# EAGLE design node (EAGLE 5.12)
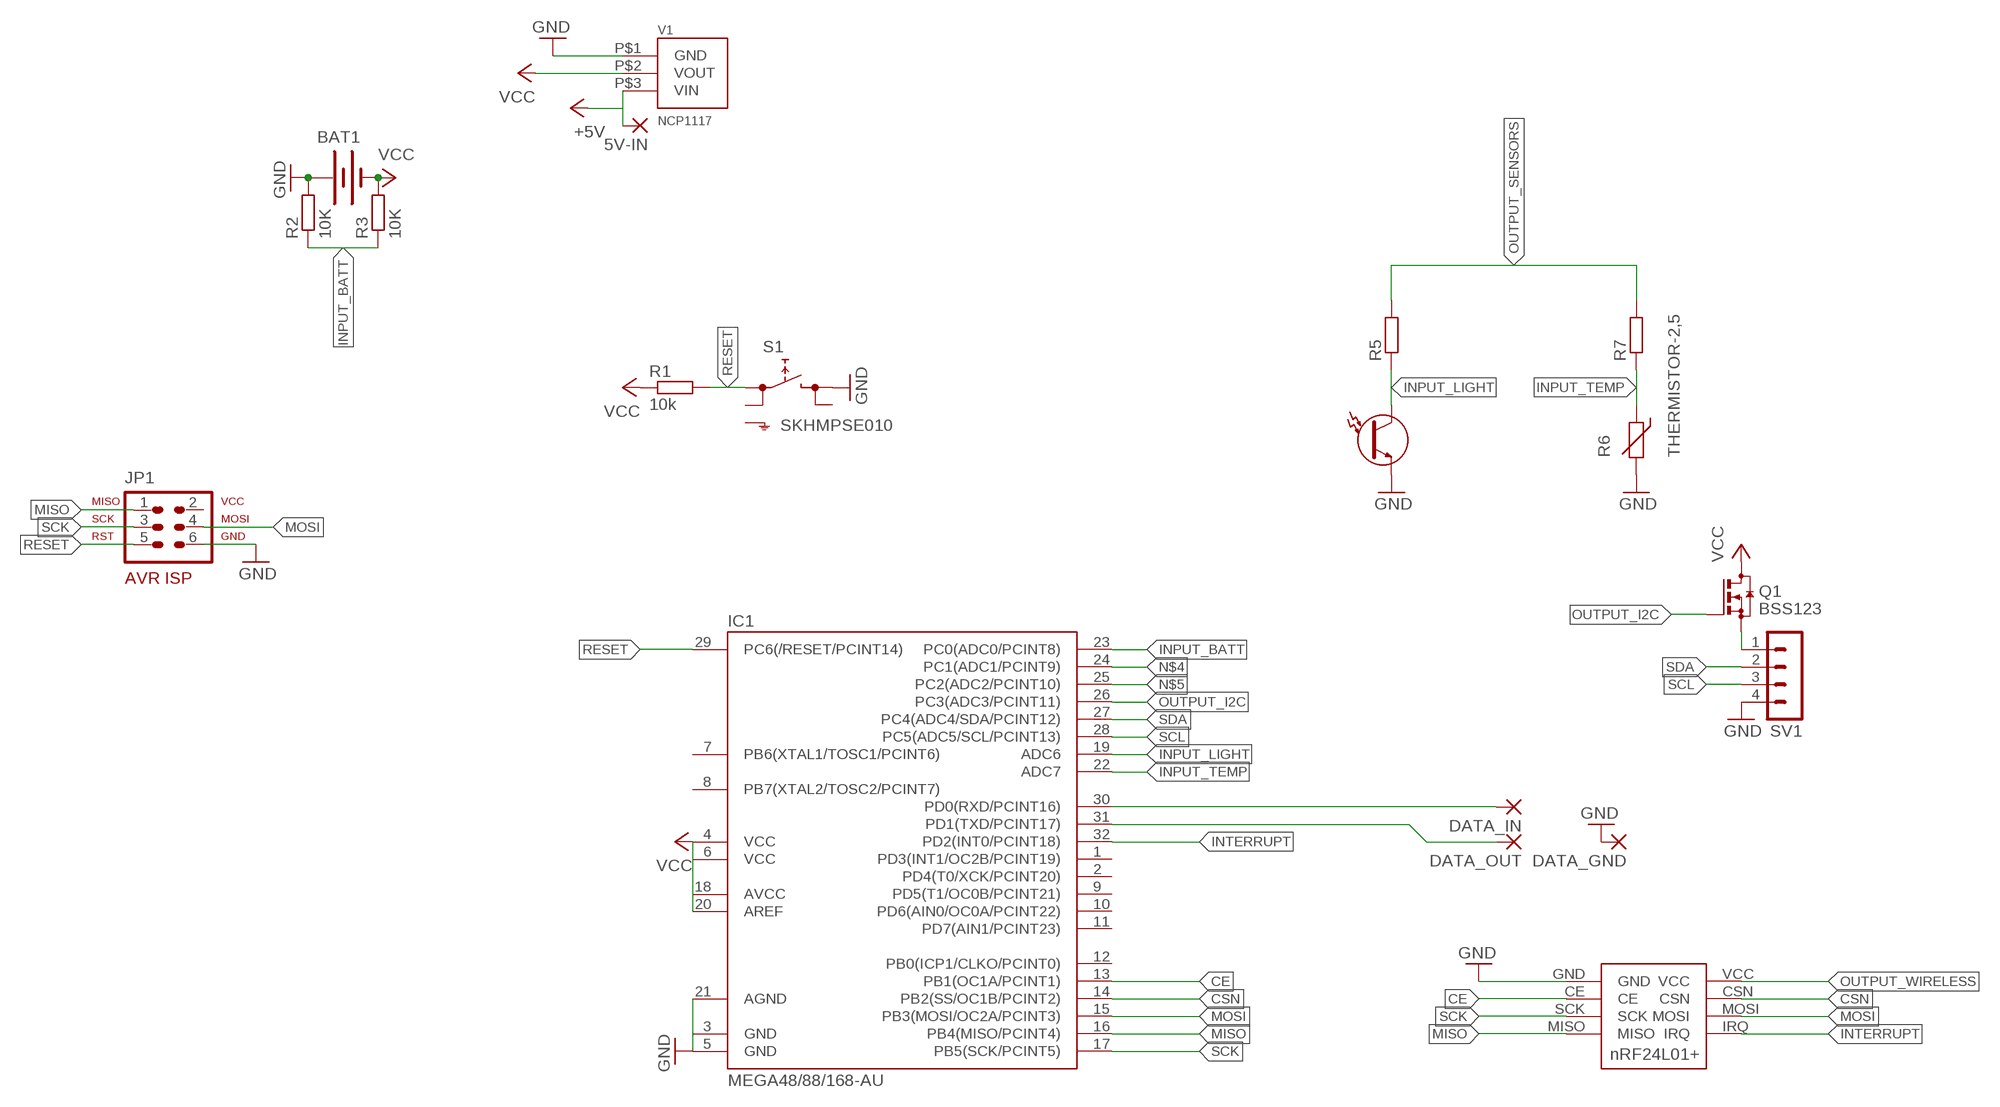
[diagram p0: schematic, sheet 1]

## Parts
5V-IN  2,54/1,1  [2,54/1,1]
BAT1  BATTERY20PTH  [BATTCOM_20MM_PTH]
CHINESE1  NRF24L01+CHINESE  [CHINESE]
DATA_GND  2,54/1,1  [2,54/1,1]
DATA_IN  2,54/1,1  [2,54/1,1]
DATA_OUT  2,54/1,1  [2,54/1,1]
IC1  MEGA48/88/168-AU  [TQFP32-08]
JP1  AVR-ISP-6VERT  [AVR-ISP-6]
Q1  BSS123  [SOT23]
R1  10k  R-EU_R0805  [R0805]
R2  10K  R-EU_M0805  [M0805]
R3  10K  R-EU_M0805  [M0805]
R5  R-EU_M0805  [M0805]
R6  THERMISTOR-2,5  [RS-2,5]
R7  R-EU_M0805  [M0805]
S1  SKHMPSE010  [SKHMPXE010]
SV1  MA04-1  [MA04-1]
U$1  FLD00030  [0603]
V1  NCP1117  [SOT_223]

## Nets
+5V: 5V-IN.1(P) V1.P$3(VIN)
CE: CHINESE1.CE IC1.13(PB1(OC1A/PCINT1))
CSN: CHINESE1.CSN IC1.14(PB2(SS/OC1B/PCINT2))
GND: BAT1.1(+) CHINESE1.GND DATA_GND.1(P) IC1.3(GND) IC1.5(GND) IC1.21(AGND) JP1.6 R2.2 R6.2 S1.3(2.1) SV1.4 U$1.EMITTER V1.P$1(GND)
INPUT_BATT: IC1.23(PC0(ADC0/PCINT8)) R2.1 R3.1
INPUT_LIGHT: IC1.19(ADC6) R5.1 U$1.COLLECTOR
INPUT_TEMP: IC1.22(ADC7) R6.1 R7.1
INTERRUPT: CHINESE1.IRQ IC1.32(PD2(INT0/PCINT18))
MISO: CHINESE1.MISO IC1.16(PB4(MISO/PCINT4)) JP1.1
MOSI: CHINESE1.MOSI IC1.15(PB3(MOSI/OC2A/PCINT3)) JP1.4
N$4: IC1.24(PC1(ADC1/PCINT9))
N$5: IC1.25(PC2(ADC2/PCINT10))
N$6: Q1.2(S) SV1.1
OUTPUT_I2C: IC1.26(PC3(ADC3/PCINT11)) Q1.1(G)
OUTPUT_SENSORS: R5.2 R7.2
OUTPUT_WIRELESS: CHINESE1.VCC
RESET: IC1.29(PC6(/RESET/PCINT14)) JP1.5 R1.2 S1.1(1.1)
RX: DATA_IN.1(P) IC1.30(PD0(RXD/PCINT16))
SCK: CHINESE1.SCK IC1.17(PB5(SCK/PCINT5)) JP1.3
SCL: IC1.28(PC5(ADC5/SCL/PCINT13)) SV1.3
SDA: IC1.27(PC4(ADC4/SDA/PCINT12)) SV1.2
TX: DATA_OUT.1(P) IC1.31(PD1(TXD/PCINT17))
VCC: BAT1.2(-) IC1.4(VCC) IC1.6(VCC) IC1.18(AVCC) IC1.20(AREF) Q1.3(D) R1.1 R3.2 V1.P$2(VOUT)
Unconnected: IC1.1(PD3(INT1/OC2B/PCINT19)) IC1.2(PD4(T0/XCK/PCINT20)) IC1.7(PB6(XTAL1/TOSC1/PCINT6)) IC1.8(PB7(XTAL2/TOSC2/PCINT7)) IC1.9(PD5(T1/OC0B/PCINT21)) IC1.10(PD6(AIN0/OC0A/PCINT22)) IC1.11(PD7(AIN1/PCINT23)) IC1.12(PB0(ICP1/CLKO/PCINT0)) JP1.2 S1.2(1.2) S1.4(2.2) S1.5(SH)

## Library data of the parts
5V-IN DATA_GND DATA_IN DATA_OUT = wirepad:2,54/1,1: THROUGH-HOLE PAD
BAT1 = SparkFun:BATTERY: Battery Holders Various common sizes : AA, AAA, 20mm coin cell and 12mm coin cell.
CHINESE1 = nrf24l01+:NRF24L01+
IC1 = avr-7:MEGA48/88/168
JP1 = avr-7:AVR-ISP-6: AVR ISP-6 Serial Programming Header
Q1 = transistor-small-signal:BSS123: N-CHANNEL MOS FET
R1-R3 R5 R7 = rcl:R-EU_: RESISTOR, European symbol
R6 = varistor:THERMISTOR: THERMISTOR
S1 = switch:SKHMP*E010: 6.2 X 6.5mm TACT Switch (SMD) Source: http://www3.alps.co.jp/WebObjects/catalog.woa/PDF/E/Switch/Tact/SKHM/SKHM.PDF
SV1 = con-lstb:MA04-1: PIN HEADER; OC_FARNELL: unknown; OC_NEWARK: unknown
U$1 = phototransistor:FLD00030: FLD00030 Analog Ambient Light Sensor The FLD00030 is a small, low profile photo detector. It incorporates a phototransistor detector chip which makes it an ideal choice for low cost ambient light measurement applications like mobile appliances backlighting.
V1 = NBitWonder:NCP1117: 1.0A Low dropout linear regulator

## Board
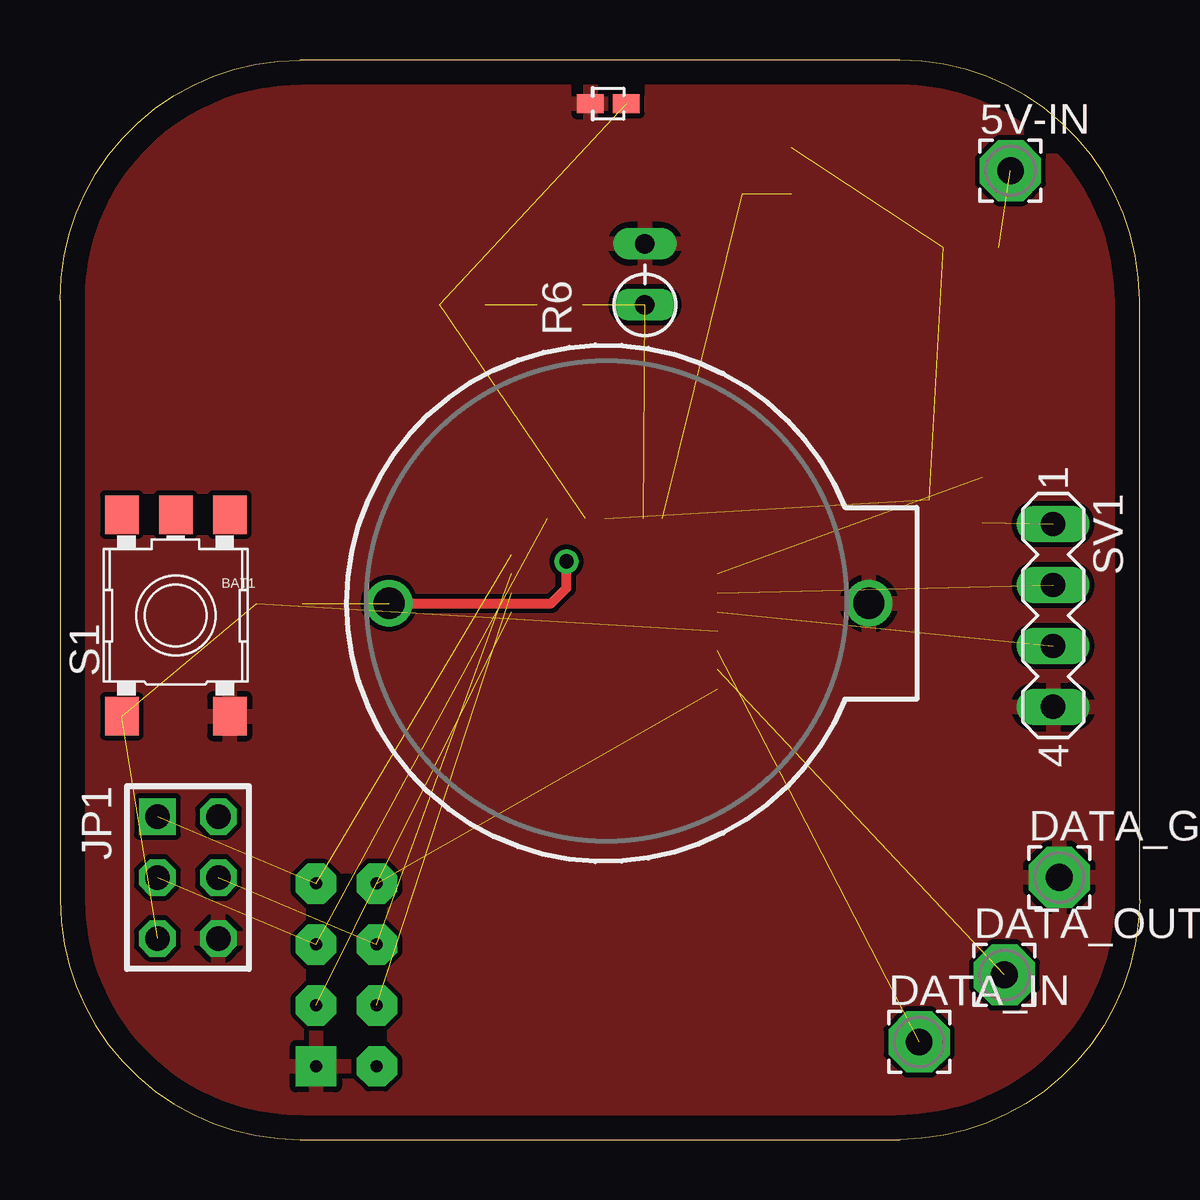
[diagram p1: board, top side]
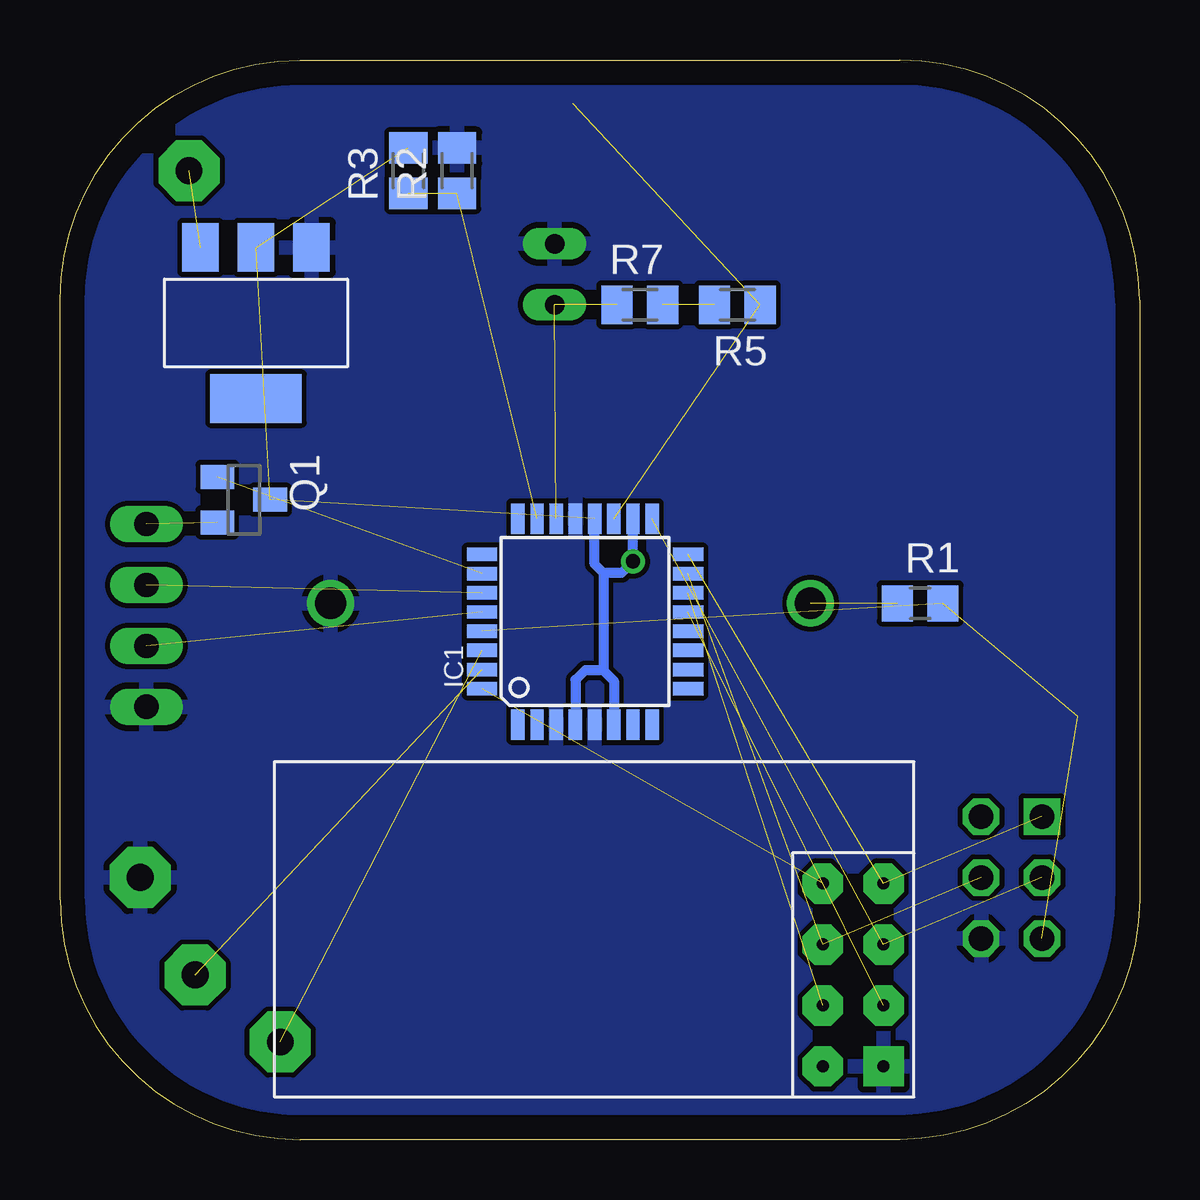
[diagram p2: board, bottom side, seen from below]

Size 45 x 45 mm. Coordinates in mm from the lower left corner, seen from the top.
Outline: 10,0 35,0 arc90 45,10 45,35 arc90 35,45 10,45 arc90 0,35 0,10 arc90 10,0
Copper layers (1*16): Top 0.035mm / dielectric 1.5mm / Bottom 0.035mm
Design rules "default": minimum track width 10mil, minimum drill 0.6mm, track to track 8mil, track to pad 8mil, pad to pad 8mil, via to via 8mil, smd to smd 8mil, copper to edge 40mil, drill to drill 8mil, minimum pad ring 10mil, minimum via ring 8mil, stop-mask expansion 4mil, vias tented up to drill 0mil, thermal gap 10mil

### Footprints (pad centres in the part's own frame; a part is rotated, then mirrored left to right if it is on the bottom)
2,54/1,1 = drill 1.118 pad 2.54 octagon: 1 0,0
BATTCOM_20MM_PTH = drill 1.3 round: 1 20,0; 2 0,0
CHINESE = drill 0.5 pad 1.676 octagon: CE 0,-2.54; CSN 2.54,-2.54; IRQ 2.54,-7.62; MISO 0,-7.62; MOSI 2.54,-5.08; SCK 0,-5.08; VCC 2.54,0 | drill 0.5 pad 1.676 square: GND 0,0
TQFP32-08 = smd 1.27 x 0.559: 1 -4.293,2.8; 2 -4.293,2; 3 -4.293,1.2; 4 -4.293,0.4; 5 -4.293,-0.4; 6 -4.293,-1.2; 7 -4.293,-2; 8 -4.293,-2.8; 17 4.293,-2.8; 18 4.293,-2; 19 4.293,-1.2; 20 4.293,-0.4; 21 4.293,0.4; 22 4.293,1.2; 23 4.293,2; 24 4.293,2.8 | smd 0.559 x 1.27: 9 -2.8,-4.293; 10 -2,-4.293; 11 -1.2,-4.293; 12 -0.4,-4.293; 13 0.4,-4.293; 14 1.2,-4.293; 15 2,-4.293; 16 2.8,-4.293; 25 2.8,4.293; 26 2,4.293; 27 1.2,4.293; 28 0.4,4.293; 29 -0.4,4.293; 30 -1.2,4.293; 31 -2,4.293; 32 -2.8,4.293
AVR-ISP-6 = drill 1.016 square: 1 -2.54,-1.27 | drill 1.016 octagon: 2 -2.54,1.27; 3 0,-1.27; 4 0,1.27; 5 2.54,-1.27; 6 2.54,1.27
SOT23 = smd 1 x 1.4: 1 -0.95,-1.1; 2 0.95,-1.1; 3 0,1.1
R0805 = smd 1.3 x 1.5: 1 -0.95,0; 2 0.95,0
M0805 = smd 1.3 x 1.6: 1 -0.95,0; 2 0.95,0
RS-2,5 = drill 0.813 long: 1 -1.27,0; 2 1.27,0
SKHMPXE010 = smd 1.6 x 1.4: 1 -4.2,2.25; 2 4.2,2.25; 3 -4.2,-2.25; 4 4.2,-2.25; 5 4.2,0
MA04-1 = drill 1.016 long: 1 -3.81,0; 2 -1.27,0; 3 1.27,0; 4 3.81,0
0603 = smd 1.1 x 0.8: COLLECTOR -0.75,0; EMITTER 0.75,0
SOT_223 = smd 3.81 x 2.032: HS 0,3.15 | smd 1.524 x 2.032: P$1 -2.311,-3.15; P$2 0,-3.15; P$3 2.311,-3.15

### Placement (x,y rotation side)
5V-IN  39.62,40.39 0 top
BAT1  13.72,22.35 0 top
CHINESE1  10.67,3.05 180 bottom
DATA_GND  41.66,10.92 0 top
DATA_IN  35.81,4.06 0 top
DATA_OUT  39.37,6.86 0 top
IC1  23.11,21.59 90 bottom
JP1  5.33,10.92 270 top
Q1  37.34,26.67 270 bottom
R1  9.14,22.35 0 bottom
R2  28.45,40.39 90 bottom
R3  30.48,40.39 90 bottom
R5  16.76,34.8 180 bottom
R6  24.38,36.07 90 top
R7  20.83,34.8 0 bottom
S1  4.83,21.84 90 top
SV1  41.4,21.84 270 top
U$1  22.86,43.18 180 top
V1  36.83,34.04 180 bottom

### Tracks (layer width: path | path; a pad name or v marks a point on that pad's centre or on a via)
+5V  (1 unrouted)
CE  (1 unrouted)
CSN  (1 unrouted)
GND
  pour Top: -5,50 50,50 50,-5 -5,-5
  pour Bottom: -5,55 50,55 50,-5 -5,-5
INPUT_BATT  (2 unrouted)
INPUT_LIGHT  (2 unrouted)
INPUT_TEMP  (2 unrouted)
INTERRUPT  (1 unrouted)
MISO  (2 unrouted)
MOSI  (2 unrouted)
N$6  (1 unrouted)
OUTPUT_I2C  (1 unrouted)
OUTPUT_SENSORS  (1 unrouted)
RESET  (3 unrouted)
RX  (1 unrouted)
SCK  (2 unrouted)
SCL  (1 unrouted)
SDA  (1 unrouted)
TX  (1 unrouted)
VCC  (via drill 0.6)  (4 unrouted)
  Top 0.406: v21.11,24.1 21.11,22.99 20.48,22.35 BAT1.2
  Bottom 0.406: IC1.20 22.71,23.98 22.35,23.62 | IC1.18 v21.11,24.1 21.59,23.62 22.35,23.62 | IC1.6 21.91,19.12 22.35,19.56 | IC1.4 23.51,19.16 23.11,19.56 22.35,19.56 | 22.35,23.62 22.35,19.56